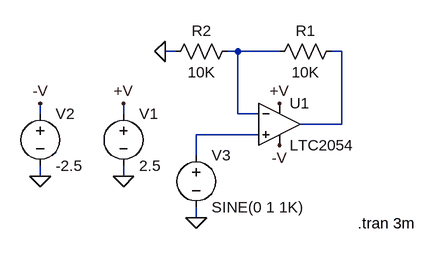
[diagram p0: schematic 2054.asc]
2054.asc, the LTspice schematic file:
Version 4
SHEET 1 896 680
WIRE -48 -16 -64 -16
WIRE 48 -16 32 -16
WIRE 112 -16 48 -16
WIRE 208 -16 192 -16
WIRE -256 80 -256 64
WIRE -128 80 -128 64
WIRE 48 80 48 -16
WIRE 80 80 48 80
WIRE 208 96 208 -16
WIRE 208 96 144 96
WIRE 80 112 -16 112
WIRE -16 144 -16 112
WIRE -256 176 -256 160
WIRE -128 176 -128 160
WIRE -16 240 -16 224
FLAG -128 176 0
FLAG 112 64 +V
FLAG -128 64 +V
FLAG 112 128 -V
FLAG -256 176 0
FLAG -256 64 -V
FLAG -16 240 0
FLAG -64 -16 0
SYMBOL voltage -128 64 R0
SYMATTR InstName V1
SYMATTR Value 2.5
SYMBOL voltage -256 64 R0
SYMATTR InstName V2
SYMATTR Value -2.5
SYMBOL voltage -16 128 R0
SYMATTR InstName V3
SYMATTR Value SINE(0 1 1K)
SYMBOL res 208 -32 R90
WINDOW 0 0 56 VBottom 2
WINDOW 3 32 56 VTop 2
SYMATTR InstName R1
SYMATTR Value 10K
SYMBOL res 48 -32 R90
WINDOW 0 0 56 VBottom 2
WINDOW 3 32 56 VTop 2
SYMATTR InstName R2
SYMATTR Value 10K
SYMBOL opamps\\LTC2054 112 96 R0
SYMATTR InstName U1
TEXT 232 248 Left 2 !.tran 3m

The netlist it stands for:
* 2054.asc
V1 +V 0 2.5
V2 -V 0 -2.5
V3 N003 0 SINE(0 1 1K)
R1 N002 N001 10K
R2 N001 0 10K
XU1 N003 N001 N002 +V -V LTC2054  ; pins In+ In- OUT V+ V-
.tran 3m
.lib LTC2.lib
.backanno
.end